# Altium schematic sheet Sheet1.SchDoc
size A4
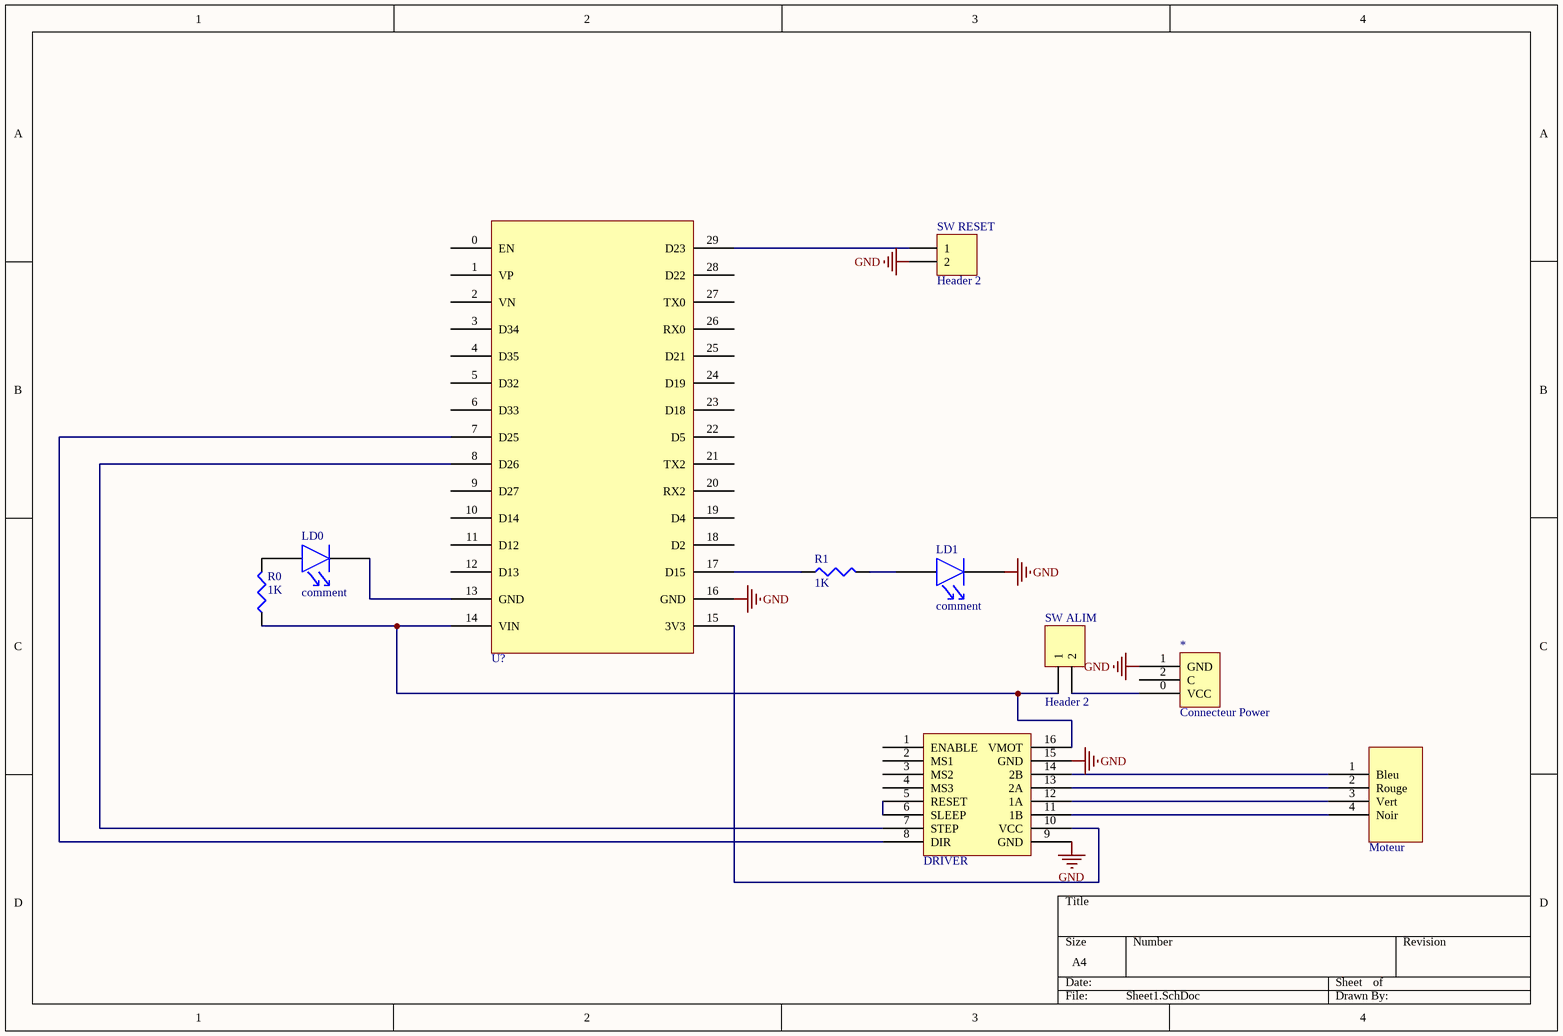
[diagram p0: Sheet1.SchDoc]

## Parts
*  Connecteur Power  [Connecteur Power]
DRIVER  Driver  [Driver]  (value not drawn)
LD0  comment  [LED5]
LD1  comment  [LED5]
Moteur  Moteur  [Moteur]  (value not drawn)
R0  value 1K  [AXIAL0.3]  (hidden comment: RES)
R1  value 1K  [AXIAL0.3]  (hidden comment: RES)
SW_ALIM  Header 2  [HDR1X2]
SW_RESET  Header 2  [HDR1X2]
U?  ESP32devKit  [ESP32]  (value not drawn)

## Nets
GND: *.1(GND) DRIVER.9(GND) DRIVER.15(GND) LD1.K SW_RESET.2 U?.16(GND)
Net*_0: *.0(VCC) SW_ALIM.2
NetDRIVER_5: DRIVER.5(RESET) DRIVER.6(SLEEP)
NetDRIVER_7: DRIVER.7(STEP) U?.8(D26)
NetDRIVER_8: DRIVER.8(DIR) U?.7(D25)
NetDRIVER_10: DRIVER.10(VCC) U?.15(3V3)
NetDRIVER_11: DRIVER.11(1B) Moteur.4(Noir)
NetDRIVER_12: DRIVER.12(1A) Moteur.3(Vert)
NetDRIVER_13: DRIVER.13(2A) Moteur.2(Rouge)
NetDRIVER_14: DRIVER.14(2B) Moteur.1(Bleu)
NetDRIVER_16: DRIVER.16(VMOT) R0.1 SW_ALIM.1 U?.14(VIN)
NetLD0_A: LD0.A R0.2
NetLD0_K: LD0.K U?.13(GND)
NetLD1_A: LD1.A R1.2
NetR1_1: R1.1 U?.17(D15)
NetSW_RESET_1: SW_RESET.1 U?.29(D23)

Not connected (* = marked no-connect by the designer): * 2(C); DRIVER 1(ENABLE) 2(MS1) 3(MS2) 4(MS3); U? 0(EN) 1(VP) 2(VN) 3(D34) 4(D35) 5(D32) 6(D33) 9(D27) 10(D14) 11(D12) 12(D13) 18(D2) 19(D4) 20(RX2) 21(TX2) 22(D5) 23(D18) 24(D19) 25(D21) 26(RX0) 27(TX0) 28(D22)

## Library data of the parts
DRIVER = Driver: Driver A4988
LD0 LD1 = LED: LED 5mm/3mm/CMS
R0 R1 = RES: resistance
SW_ALIM SW_RESET = Header 2: Header, 2-Pin; LatestRevisionDate: 17-Jul-2002; LatestRevisionNote: Re-released for DXP Platform.; Publisher: Altium Limited